# Altium schematic sheet 4_Codec.SchDoc
size A; SheetNumber: 4; SheetTotal: 6
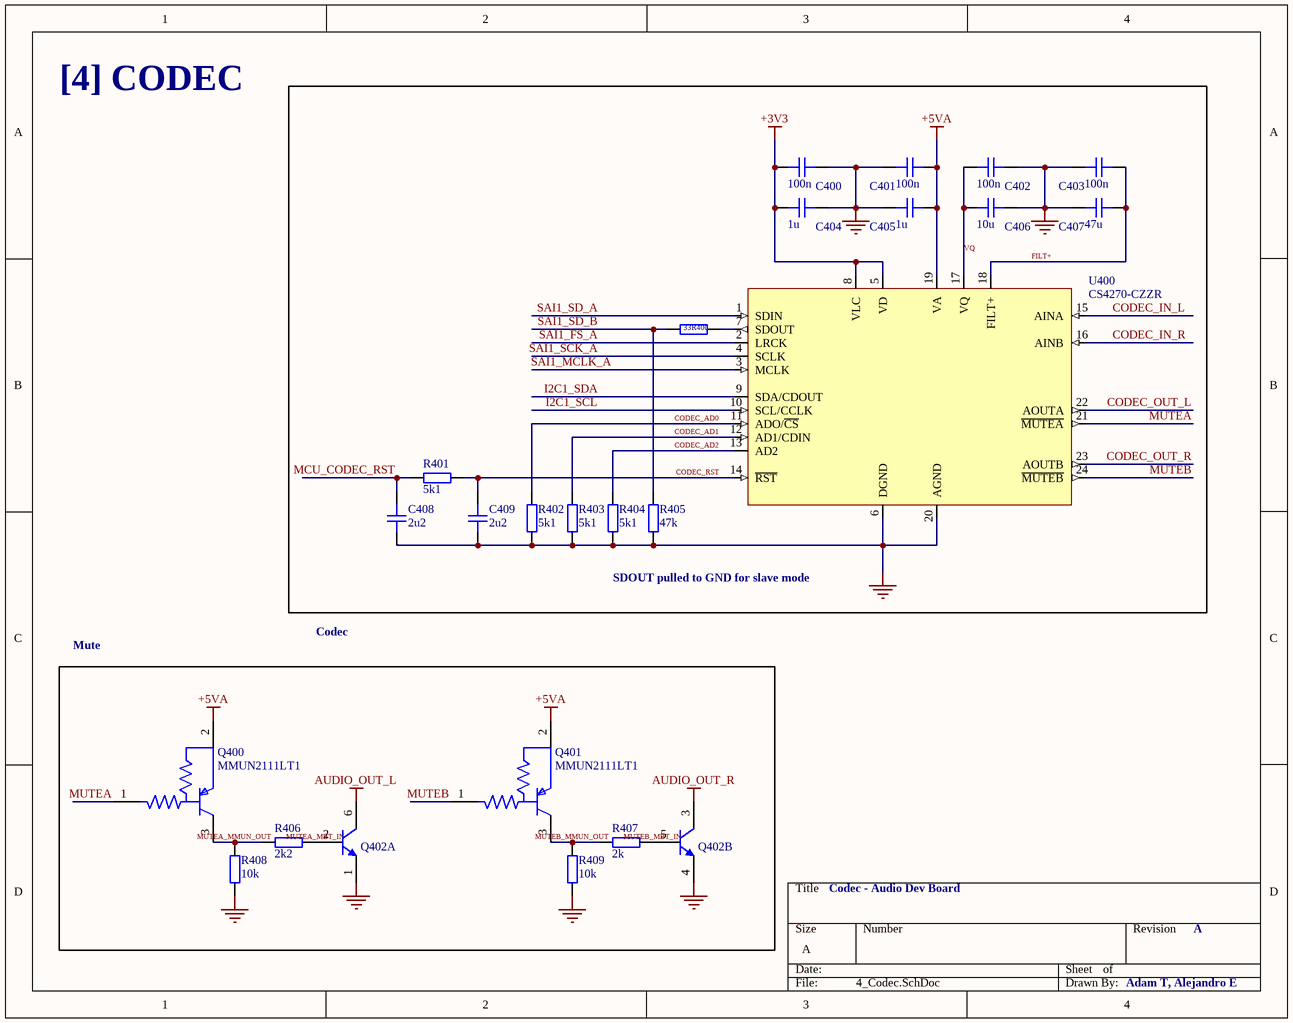
[diagram p0: 4_Codec.SchDoc]

## Parts
C400  100n  [CAP_0402]
C401  100n  [CAP_0402]
C402  100n  [CAP_0402]
C403  100n  [CAP_0402]
C404  1u  [CAP_0603]
C405  1u  [CAP_0603]
C406  10u  [CAP_0603]
C407  47u  [CAP_1210]
C408  2u2  [CAP_0402]
C409  2u2  [CAP_0402]
Q400  MMUN2111LT1  [FP-318-08-MFG]
Q401  MMUN2111LT1  [FP-318-08-MFG]
Q402  MBT3904DW1T1G  [ONSC-SOT-363-6-419B-02_W_V]  (value not drawn)  (parts A,B of 2)
R400  33  [RES_0402]
R401  5k1  [RES_0402]
R402  5k1  [RES_0402]
R403  5k1  [RES_0402]
R404  5k1  [RES_0402]
R405  47k  [RES_0402]
R406  2k2  [RES_0402]
R407  2k  [RES_0402]
R408  10k  [RES_0402]
R409  10k  [RES_0402]
U400  CS4270-CZZR  [TSSOP-24]

## Blocks framed on the sheet
SDOUT pulled to GND for slave mode: C400-C409 R400-R405 U400
Mute: Q400-Q402 R406-R409

## Nets
+3V3: C400.1 C404.2 U400.5(VD) U400.8(VLC)
+5VA: C401.1 C405.2 Q400.2(E) Q401.2(E) U400.19(VA)
AUDIO_OUT_L: Q402.6(C)
AUDIO_OUT_R: Q402.3(C)
GND: C400.2 C401.2 C402.2 C403.2 C404.1 C405.1 C406.1 C407.1 C408.1 C409.1 Q402.1(E) Q402.4(E) R402.1 R403.1 R404.1 R405.1 R408.1 R409.1 U400.6(DGND) U400.20(AGND)
CODEC_AD0: R402.2 U400.11(ADO/~{CS})
CODEC_AD1: R403.2 U400.12(AD1/CDIN)
CODEC_AD2: R404.2 U400.13(AD2)
CODEC_IN_L: U400.15(AINA)
CODEC_IN_R: U400.16(AINB)
CODEC_OUT_L: U400.22(AOUTA)
CODEC_OUT_R: U400.23(AOUTB)
CODEC_RST: C409.2 R401.1 U400.14(~{RST})
FILT+: C403.1 C407.2 U400.18(FILT+)
I2C1_SCL: U400.10(SCL/CCLK)
I2C1_SDA: U400.9(SDA/CDOUT)
MCU_CODEC_RST: C408.2 R401.2
MUTEA: Q400.1(B) U400.21(~{MUTEA})
MUTEA_MBT_IN: Q402.2(B) R406.2
MUTEA_MMUN_OUT: Q400.3(C) R406.1 R408.2
MUTEB: Q401.1(B) U400.24(~{MUTEB})
MUTEB_MBT_IN: Q402.5(B) R407.2
MUTEB_MMUN_OUT: Q401.3(C) R407.1 R409.2
SAI1_FS_A: U400.2(LRCK)
SAI1_MCLK_A: U400.3(MCLK)
SAI1_SCK_A: U400.4(SCLK)
SAI1_SD_A: U400.1(SDIN)
SAI1_SD_B: R400.1 R405.2
VQ: C402.1 C406.2 U400.17(VQ)
NetR400_2: R400.2 U400.7(SDOUT)

## Notes on the sheet
- [4] CODEC
- Codec
- Codec - Audio Dev Board
- A
- Adam T, Alejandro E

## Library data of the parts
C400-C403 C408 C409 = CAP_0402: Capacitor SMD 0402; Manufacturer: *; Manufacturer Part Number: *; Distributor Link: *; LCSC: *; Rating: *; Dielectric: *
C404-C406 = CAP_0603: Capacitor SMD 0603; Manufacturer: *; Manufacturer Part Number: *; Distributor Link: *; LCSC: *; Rating: *; Dielectric: *
C407 = CAP_1210: Capacitor SMD 1210; Manufacturer: *; Manufacturer Part Number: *; Distributor Link: *; LCSC: *; Rating: *; Dielectric: *
Q400 Q401 = CMP-00278-00358179-1: MMUN2111LT1 Small Signal Bipolar Transistor, 0.1A I(C), 50V V(BR)CEO, 1-Element, PNP, Silicon, TO-236AB; NexarPartId: 358179; Power Dissipation: 246mW; Current Rating: -100mA; Current: 1A; Max Junction Temperature (Tj): 150°C; Number of Elements: 1; Max Collector Current: 100mA; Element Configuration: Single; Voltage Rating (DC): -50V; hFE Min: 35; Collector Emitter Saturation Voltage: 250mV; Collector Base Voltage (VCBO): 50V; Min Operating Temperature: -55°C; Max Operating Temperature: 150°C; Packaging: Cut Tape (CT); Collector Emitter Voltage (VCEO): 50V; Max Power Dissipation: 246mW; Height: 1.11mm; Case/Package: SOT-23-3; Continuous Collector Current: 100mA; Number of Pins: 3; Voltage: 50V; RoHS: Compliant; Collector Emitter Breakdown Voltage: 50V; Mount: Surface Mount; Lead Free: Contains Lead; Polarity: PNP
Q402 = CMP-1048-00877-1: Dual General Purpose Transistors, 6-Pin SOT-363, Pb-Free, Tape and Reel; Manufacturer: On Semiconductor; Polarity: Dual NPN; fT Min (MHz): 300; IC Continuous (A): 0.2; DatasheetVersion: Rev. 9; ComponentLink2Description: Datasheet; Mounting Technology: Surface Mount; PackageReference: SOT-363-6-419B-02_W; RoHS: TRUE; ComponentLink1Description: Manufacturer URL; ComponentLink2URL: http://www.onsemi.com/pub_link/Collateral/MBT3904DW1T1-D.PDF; PackageVersion: Rev. W, 01/2006; Packing: Tape and Reel; PartNumber: MBT3904DW1T1G; ComponentLink1URL: http://www.onsemi.com/; ComponentLink3URL: http://www.onsemi.com/pub_link/Collateral/NTJD4001N-D.PDF; ComponentLink3Description: Package Specification; PackageDescription: 6-Pin Small Outline Transistor, Body 2 x 1.25 mm, Pitch 0.65 mm
R400-R409 = RES_0402: Resistor SMD 0402
  R401-R409: Manufacturer: *; Manufacturer Part Number: *; Distributor Link: *; LCSC: *
U400 = CS4270-CZZR: 24-Bit 192kHz Stereo Audio Codec TSSOP-24; Manufacturer: Cirrus Logic; Manufacturer Part Number: CS4270-CZZR